# Altium project SJ2088POE.PrjPcb (part 1 of 9)
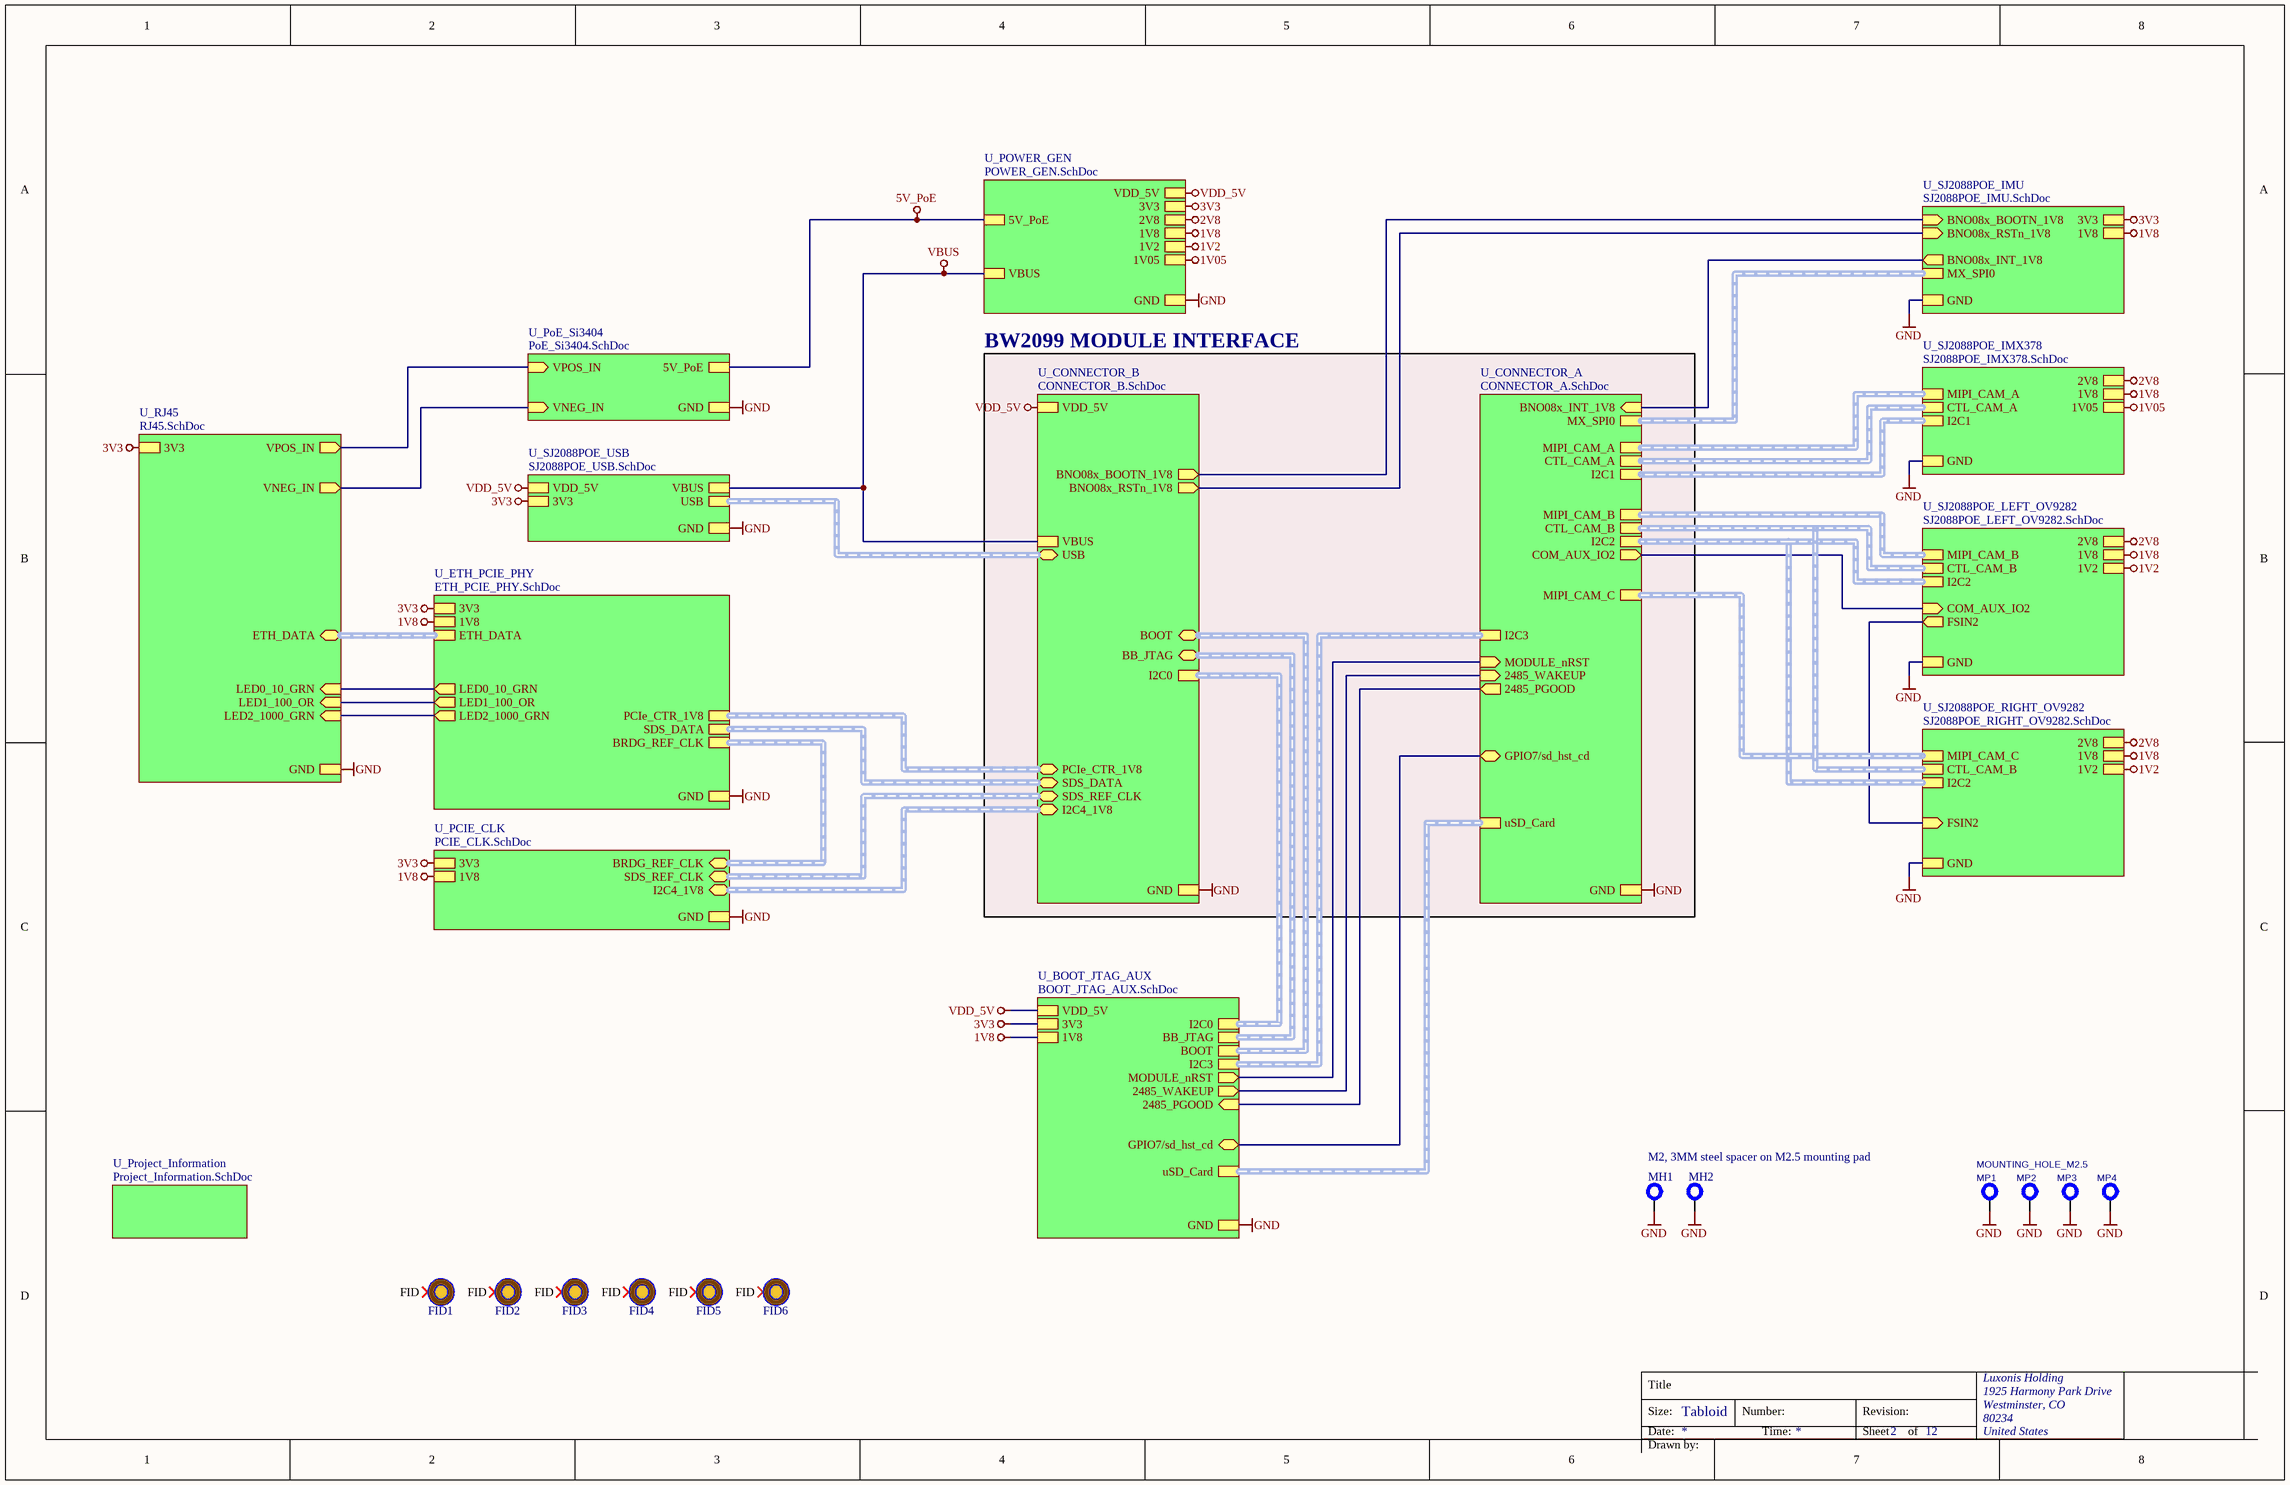
[diagram p0: TopLevel.SchDoc]
revision1: R2M0E2; project_title: SJ2088POE; drawn_by: Brian Weinstein / Sandesh Joshi; document_number: D2088000
15 sheets, 309 parts. Net scope: strictly hierarchical (ports join the sheet entries above them; power ports are local).
Board file: SJ2088POE.PcbDoc
Sheets:
  TopLevel.SchDoc
    U_Project_Information = Project_Information.SchDoc
    U_CONNECTOR_B = CONNECTOR_B.SchDoc
    U_CONNECTOR_A = CONNECTOR_A.SchDoc
    U_ETH_PCIE_PHY = ETH_PCIE_PHY.SchDoc
    U_RJ45 = RJ45.SchDoc
    U_PCIE_CLK = PCIE_CLK.SchDoc
    U_SJ2088POE_USB = SJ2088POE_USB.SchDoc
    U_BOOT_JTAG_AUX = BOOT_JTAG_AUX.SchDoc
    U_PoE_Si3404 = PoE_Si3404.SchDoc
    U_POWER_GEN = POWER_GEN.SchDoc
    U_SJ2088POE_IMX378 = SJ2088POE_IMX378.SchDoc
    U_SJ2088POE_RIGHT_OV9282 = SJ2088POE_RIGHT_OV9282.SchDoc
    U_SJ2088POE_LEFT_OV9282 = SJ2088POE_LEFT_OV9282.SchDoc
    U_SJ2088POE_IMU = SJ2088POE_IMU.SchDoc

## Sheet TopLevel.SchDoc: =project_title
size Tabloid; CompanyName: Luxonis Holding; DrawnBy: Brian Weinstein / Sandesh Joshi; Organization: Luxonis Holding; Address1: 1925 Harmony Park Drive; Address2: Westminster, CO; Address3: 80234; Address4: United States; DocumentNumber: D2088000; SheetNumber: 2; SheetTotal: 12

### Parts
FID1  FIDUCIAL_ROUND_1MM  [FIDUCIAL_ROUND_1MM]  (value not drawn)  (no BOM)
FID2  FIDUCIAL_ROUND_1MM  [FIDUCIAL_ROUND_1MM]  (value not drawn)  (no BOM)
FID3  FIDUCIAL_ROUND_1MM  [FIDUCIAL_ROUND_1MM]  (value not drawn)  (no BOM)
FID4  FIDUCIAL_ROUND_1MM  [FIDUCIAL_ROUND_1MM]  (value not drawn)  (no BOM)
FID5  FIDUCIAL_ROUND_1MM  [FIDUCIAL_ROUND_1MM]  (value not drawn)  (no BOM)
FID6  FIDUCIAL_ROUND_1MM  [FIDUCIAL_ROUND_1MM]  (value not drawn)  (no BOM)
MH1  M2, 3MM steel spacer on M2.5 mounting pad  [9774030243R]
MH2  M2, 3MM steel spacer on M2.5 mounting pad  [9774030243R]  (value not drawn)
MP1  MOUNTING_HOLE_M2.5  [MOUNTING_HOLE_M2.5]  (no BOM)
MP2  MOUNTING_HOLE_M2.5  [MOUNTING_HOLE_M2.5]  (value not drawn)  (no BOM)
MP3  MOUNTING_HOLE_M2.5  [MOUNTING_HOLE_M2.5]  (value not drawn)  (no BOM)
MP4  MOUNTING_HOLE_M2.5  [MOUNTING_HOLE_M2.5]  (value not drawn)  (no BOM)

### Sub-sheets
U_BOOT_JTAG_AUX = BOOT_JTAG_AUX.SchDoc: BOOT (harness BOOT), BB_JTAG (harness BB_JTAG), uSD_Card (harness uSD_Card), 2485_WAKEUP (out), I2C3 (harness I2C3), MODULE_nRST (out), 2485_PGOOD (in), 1V8, 3V3, GND, VDD_5V, I2C0 (harness I2C0), GPIO7/sd_hst_cd (bidir)
U_CONNECTOR_A = CONNECTOR_A.SchDoc: I2C2 (harness I2C2), I2C1 (harness I2C1), uSD_Card (harness uSD_Card), MIPI_CAM_C (harness MIPI_CAM_C), CTL_CAM_A (harness CTL_CAM_A), MIPI_CAM_A (harness MIPI_CAM_A), MIPI_CAM_B (harness MIPI_CAM_B), GND, I2C3 (harness I2C3), CTL_CAM_B (harness CTL_CAM_B), COM_AUX_IO2 (out), MODULE_nRST (in), 2485_WAKEUP (in), 2485_PGOOD (out), GPIO7/sd_hst_cd (bidir), BNO08x_INT_1V8 (in), MX_SPI0 (harness MX_SPI0)
U_CONNECTOR_B = CONNECTOR_B.SchDoc: VBUS, I2C0 (harness I2C0), VDD_5V, GND, BOOT (bidir, harness BOOT), PCIe_CTR_1V8 (bidir, harness PCIe_CTR_1V8), BB_JTAG (bidir, harness BB_JTAG), USB (bidir, harness USB), SDS_REF_CLK (bidir, harness SDS_REF_CLK), I2C4_1V8 (bidir, harness I2C4_1V8), SDS_DATA (bidir, harness Harness), BNO08x_BOOTN_1V8 (out), BNO08x_RSTn_1V8 (out)
U_ETH_PCIE_PHY = ETH_PCIE_PHY.SchDoc: ETH_DATA (harness ETH_DATA), LED0_10_GRN (out), LED1_100_OR (out), LED2_1000_GRN (out), SDS_DATA (harness Harness), 3V3, GND, BRDG_REF_CLK (harness BRDG_REF_CLK), 1V8, PCIe_CTR_1V8 (harness PCIe_CTR_1V8)
U_PCIE_CLK = PCIE_CLK.SchDoc: GND, 3V3, 1V8, BRDG_REF_CLK (bidir, harness BRDG_REF_CLK), I2C4_1V8 (bidir, harness I2C4_1V8), SDS_REF_CLK (bidir, harness SDS_REF_CLK)
U_PoE_Si3404 = PoE_Si3404.SchDoc: 5V_PoE, GND, VPOS_IN (in), VNEG_IN (in)
U_POWER_GEN = POWER_GEN.SchDoc: GND, 3V3, 1V8, 5V_PoE, VBUS, 1V2, 2V8, 1V05, VDD_5V
U_Project_Information = Project_Information.SchDoc: no entries
U_RJ45 = RJ45.SchDoc: GND, LED0_10_GRN (in), 3V3, LED2_1000_GRN (in), LED1_100_OR (in), VPOS_IN (out), VNEG_IN (out), ETH_DATA (bidir, harness ETH_DATA)
U_SJ2088POE_IMU = SJ2088POE_IMU.SchDoc: BNO08x_BOOTN_1V8 (in), GND, 3V3, BNO08x_INT_1V8 (out), BNO08x_RSTn_1V8 (in), 1V8, MX_SPI0 (harness MX_SPI0)
U_SJ2088POE_IMX378 = SJ2088POE_IMX378.SchDoc: 2V8, 1V05, I2C1 (harness I2C1), MIPI_CAM_A (harness MIPI_CAM_A), CTL_CAM_A (harness CTL_CAM_A), GND, 1V8
U_SJ2088POE_LEFT_OV9282 = SJ2088POE_LEFT_OV9282.SchDoc: I2C2 (harness I2C2), CTL_CAM_B (harness CTL_CAM_B), MIPI_CAM_B (harness MIPI_CAM_B), 1V2, 2V8, GND, 1V8, FSIN2 (out), COM_AUX_IO2 (in)
U_SJ2088POE_RIGHT_OV9282 = SJ2088POE_RIGHT_OV9282.SchDoc: MIPI_CAM_C (harness MIPI_CAM_C), I2C2 (harness I2C2), 1V2, 2V8, GND, 1V8, FSIN2 (in), CTL_CAM_B (harness CTL_CAM_B)
U_SJ2088POE_USB = SJ2088POE_USB.SchDoc: USB (harness USB), GND, 3V3, VBUS, VDD_5V

### Nets
1V2: sheet U_POWER_GEN/1V2, sheet U_SJ2088POE_RIGHT_OV9282/1V2, sheet U_SJ2088POE_LEFT_OV9282/1V2
1V05: sheet U_POWER_GEN/1V05, sheet U_SJ2088POE_IMX378/1V05
1V8: sheet U_ETH_PCIE_PHY/1V8, sheet U_PCIE_CLK/1V8, sheet U_BOOT_JTAG_AUX/1V8, sheet U_POWER_GEN/1V8, sheet U_SJ2088POE_IMX378/1V8, sheet U_SJ2088POE_RIGHT_OV9282/1V8, sheet U_SJ2088POE_LEFT_OV9282/1V8, sheet U_SJ2088POE_IMU/1V8
2V8: sheet U_POWER_GEN/2V8, sheet U_SJ2088POE_IMX378/2V8, sheet U_SJ2088POE_RIGHT_OV9282/2V8, sheet U_SJ2088POE_LEFT_OV9282/2V8
3V3: sheet U_ETH_PCIE_PHY/3V3, sheet U_RJ45/3V3, sheet U_PCIE_CLK/3V3, sheet U_SJ2088POE_USB/3V3, sheet U_BOOT_JTAG_AUX/3V3, sheet U_POWER_GEN/3V3, sheet U_SJ2088POE_IMU/3V3
5V_PoE: sheet U_PoE_Si3404/5V_PoE, sheet U_POWER_GEN/5V_PoE
GND: MH1.1 MH2.1 MP1.1 MP2.1 MP3.1 MP4.1 ; sheet U_CONNECTOR_B/GND, sheet U_CONNECTOR_A/GND, sheet U_ETH_PCIE_PHY/GND, sheet U_RJ45/GND, sheet U_PCIE_CLK/GND, sheet U_SJ2088POE_USB/GND, sheet U_BOOT_JTAG_AUX/GND, sheet U_PoE_Si3404/GND, sheet U_POWER_GEN/GND, sheet U_SJ2088POE_IMX378/GND, sheet U_SJ2088POE_RIGHT_OV9282/GND, sheet U_SJ2088POE_LEFT_OV9282/GND, sheet U_SJ2088POE_IMU/GND
VBUS: sheet U_CONNECTOR_B/VBUS, sheet U_SJ2088POE_USB/VBUS, sheet U_POWER_GEN/VBUS
VDD_5V: sheet U_CONNECTOR_B/VDD_5V, sheet U_SJ2088POE_USB/VDD_5V, sheet U_BOOT_JTAG_AUX/VDD_5V, sheet U_POWER_GEN/VDD_5V
VNEG_IN: sheet U_RJ45/VNEG_IN, sheet U_PoE_Si3404/VNEG_IN
2485_PGOOD: sheet U_CONNECTOR_A/2485_PGOOD, sheet U_BOOT_JTAG_AUX/2485_PGOOD
2485_WAKEUP: sheet U_CONNECTOR_A/2485_WAKEUP, sheet U_BOOT_JTAG_AUX/2485_WAKEUP
BNO08x_BOOTN_1V8: sheet U_CONNECTOR_B/BNO08x_BOOTN_1V8, sheet U_SJ2088POE_IMU/BNO08x_BOOTN_1V8
BNO08x_INT_1V8: sheet U_CONNECTOR_A/BNO08x_INT_1V8, sheet U_SJ2088POE_IMU/BNO08x_INT_1V8
BNO08x_RSTn_1V8: sheet U_CONNECTOR_B/BNO08x_RSTn_1V8, sheet U_SJ2088POE_IMU/BNO08x_RSTn_1V8
COM_AUX_IO2: sheet U_CONNECTOR_A/COM_AUX_IO2, sheet U_SJ2088POE_LEFT_OV9282/COM_AUX_IO2
FSIN2: sheet U_SJ2088POE_RIGHT_OV9282/FSIN2, sheet U_SJ2088POE_LEFT_OV9282/FSIN2
GPIO7/sd_hst_cd: sheet U_CONNECTOR_A/GPIO7/sd_hst_cd, sheet U_BOOT_JTAG_AUX/GPIO7/sd_hst_cd
LED0_10_GRN: sheet U_ETH_PCIE_PHY/LED0_10_GRN, sheet U_RJ45/LED0_10_GRN
LED1_100_OR: sheet U_ETH_PCIE_PHY/LED1_100_OR, sheet U_RJ45/LED1_100_OR
LED2_1000_GRN: sheet U_ETH_PCIE_PHY/LED2_1000_GRN, sheet U_RJ45/LED2_1000_GRN
MODULE_nRST: sheet U_CONNECTOR_A/MODULE_nRST, sheet U_BOOT_JTAG_AUX/MODULE_nRST
VPOS_IN: sheet U_RJ45/VPOS_IN, sheet U_PoE_Si3404/VPOS_IN

Not connected (* = marked no-connect by the designer): FID1 FID*; FID2 FID*; FID3 FID*; FID4 FID*; FID5 FID*; FID6 FID*

### Buses and harness runs
harness sheet U_BOOT_JTAG_AUX/BB_JTAG = sheet U_CONNECTOR_B/BB_JTAG
harness sheet U_BOOT_JTAG_AUX/BOOT = sheet U_CONNECTOR_B/BOOT
harness sheet U_BOOT_JTAG_AUX/I2C0 = sheet U_CONNECTOR_B/I2C0
harness sheet U_BOOT_JTAG_AUX/I2C3 = sheet U_CONNECTOR_A/I2C3
harness sheet U_BOOT_JTAG_AUX/uSD_Card = sheet U_CONNECTOR_A/uSD_Card
harness sheet U_CONNECTOR_A/CTL_CAM_A = sheet U_SJ2088POE_IMX378/CTL_CAM_A
harness sheet U_CONNECTOR_A/CTL_CAM_B = sheet U_SJ2088POE_LEFT_OV9282/CTL_CAM_B = sheet U_SJ2088POE_RIGHT_OV9282/CTL_CAM_B
harness sheet U_CONNECTOR_A/I2C1 = sheet U_SJ2088POE_IMX378/I2C1
harness sheet U_CONNECTOR_A/I2C2 = sheet U_SJ2088POE_LEFT_OV9282/I2C2 = sheet U_SJ2088POE_RIGHT_OV9282/I2C2
harness sheet U_CONNECTOR_A/MIPI_CAM_A = sheet U_SJ2088POE_IMX378/MIPI_CAM_A
harness sheet U_CONNECTOR_A/MIPI_CAM_B = sheet U_SJ2088POE_LEFT_OV9282/MIPI_CAM_B
harness sheet U_CONNECTOR_A/MIPI_CAM_C = sheet U_SJ2088POE_RIGHT_OV9282/MIPI_CAM_C
harness sheet U_CONNECTOR_A/MX_SPI0 = sheet U_SJ2088POE_IMU/MX_SPI0
harness sheet U_CONNECTOR_B/I2C4_1V8 = sheet U_PCIE_CLK/I2C4_1V8
harness sheet U_CONNECTOR_B/PCIe_CTR_1V8 = sheet U_ETH_PCIE_PHY/PCIe_CTR_1V8
harness sheet U_CONNECTOR_B/SDS_DATA = sheet U_ETH_PCIE_PHY/SDS_DATA
harness sheet U_CONNECTOR_B/SDS_REF_CLK = sheet U_PCIE_CLK/SDS_REF_CLK
harness sheet U_CONNECTOR_B/USB = sheet U_SJ2088POE_USB/USB
harness sheet U_ETH_PCIE_PHY/BRDG_REF_CLK = sheet U_PCIE_CLK/BRDG_REF_CLK
harness sheet U_ETH_PCIE_PHY/ETH_DATA = sheet U_RJ45/ETH_DATA

### Notes on the sheet
- BW2099 MODULE INTERFACE
- Title
- Size:
- Date:
- Tabloid
- Number:
- Time:
- Revision:
- Sheet
- of
- Drawn by:

### Library data of the parts
FID1-FID6 = FIDUCIAL: Fiducial with various available footprints
MH1 MH2 = 9774030243R: MP ROUND STANDOFF M2X0.4 STEEL 3MM; Manufacturer 1: Wurth Electronics; Plating: Tin; Threaded/Unthreaded: Threaded; Outside Diameter: 0.171inch; Supplier 1: Digi-Key; Manufacturer Part Number 1: 9774030243R; Stock 1: 20568; Pricing 1: 1=0.95000, 10=0.91800, 50=0.79500, 100=0.73900 (USD); RoHS: Yes; Material: Steel; Length: 0.173inch; REACH SVHC: Unknown; ComponentLink1URL: http://www.mouser.com/ds/2/445/9774030243R-611455.pdf?src-supplier=Mouser; ComponentLink1Description: http://www.mouser.com/ds/2/445/9774030243R-611455.pdf?src-supplier=Mouser; ComponentLink2URL: http://www.farnell.com/datasheets/1960368.pdf?src-supplier=Farnell; ComponentLink2Description: http://www.farnell.com/datasheets/1960368.pdf?src-supplier=Farnell; ComponentLink3URL: https://katalog.we-online.de/em/datasheet/9774030243R.pdf?src-supplier=Digi-Key; ComponentLink3Description: https://katalog.we-online.de/em/datasheet/9774030243R.pdf?src-supplier=Digi-Key; ComponentLink4URL: http://www.farnell.com/datasheets/1960368.pdf?src-supplier=Newark; ComponentLink4Description: http://www.farnell.com/datasheets/1960368.pdf?src-supplier=Newark; ComponentLink5URL: http://www.farnell.com/datasheets/1960368.pdf?src-supplier=Element14; ComponentLink5Description: http://www.farnell.com/datasheets/1960368.pdf?src-supplier=Element14; Supplier Part Number 1: 732-7085-1-ND; Supplier 2: Mouser; Supplier Part Number 2: 710-9774030243R; Supplier 3: Element14; Supplier Part Number 3: 2497599
MP1-MP4 = MP_Mounting-Holes: =CurrentFootprint; B - Value: Not a Part; A - Level: 0

## Sheet Project_Information.SchDoc: =project_title
size Tabloid; CompanyName: Luxonis Holding; DrawnBy: Brian Weinstein / Sandesh Joshi; Organization: Luxonis Holding; Address1: 1925 Harmony Park Drive; Address2: Westminster, CO; Address3: 80234; Address4: United States; DocumentNumber: D2088000; Revision: R2M0E2; SheetNumber: 1; SheetTotal: 12
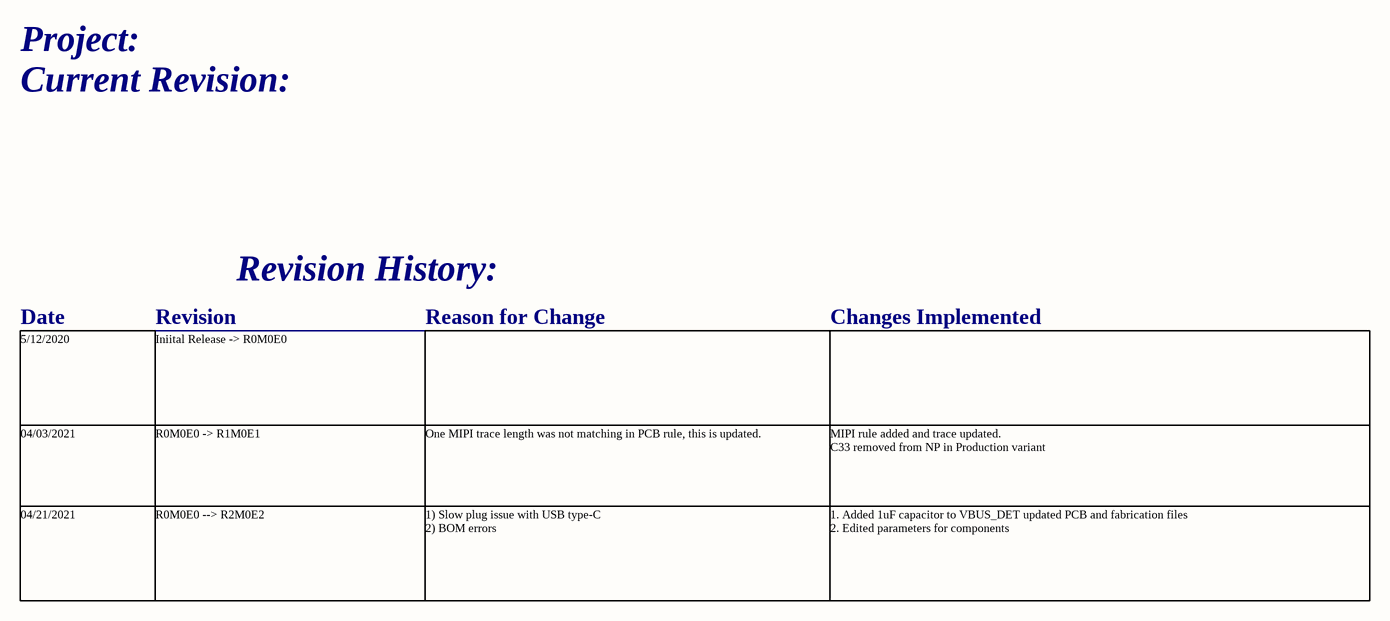
[diagram p1: Project_Information.SchDoc]

### Notes on the sheet
- Project:
- Current Revision:
- Revision History:
- Date
- Revision
- Reason for Change
- Changes Implemented
- 5/12/2020
- Iniital Release -> R0M0E0
- 04/03/2021
- R0M0E0 -> R1M0E1
- One MIPI trace length was not matching in PCB rule, this is updated.
- MIPI rule added and trace updated.
  C33 removed from NP in Production variant
- 04/21/2021
- R0M0E0 --> R2M0E2
- 1) Slow plug issue with USB type-C
  2) BOM errors
- 1. Added 1uF capacitor to VBUS_DET updated PCB and fabrication files
  2. Edited parameters for components
- Title
- Size:
- Date:
- Tabloid
- Number:
- Time:
- Revision:
- Sheet
- of
- Drawn by:

## Sheet CONNECTOR_B.SchDoc: =project_title
size Tabloid; CompanyName: Luxonis Holding; DrawnBy: Brian Weinstein / Sandesh Joshi; Organization: Luxonis Holding; Address1: 1925 Harmony Park Drive; Address2: Westminster, CO; Address3: 80234; Address4: United States; DocumentNumber: D2088000; SheetNumber: 6; SheetTotal: 12
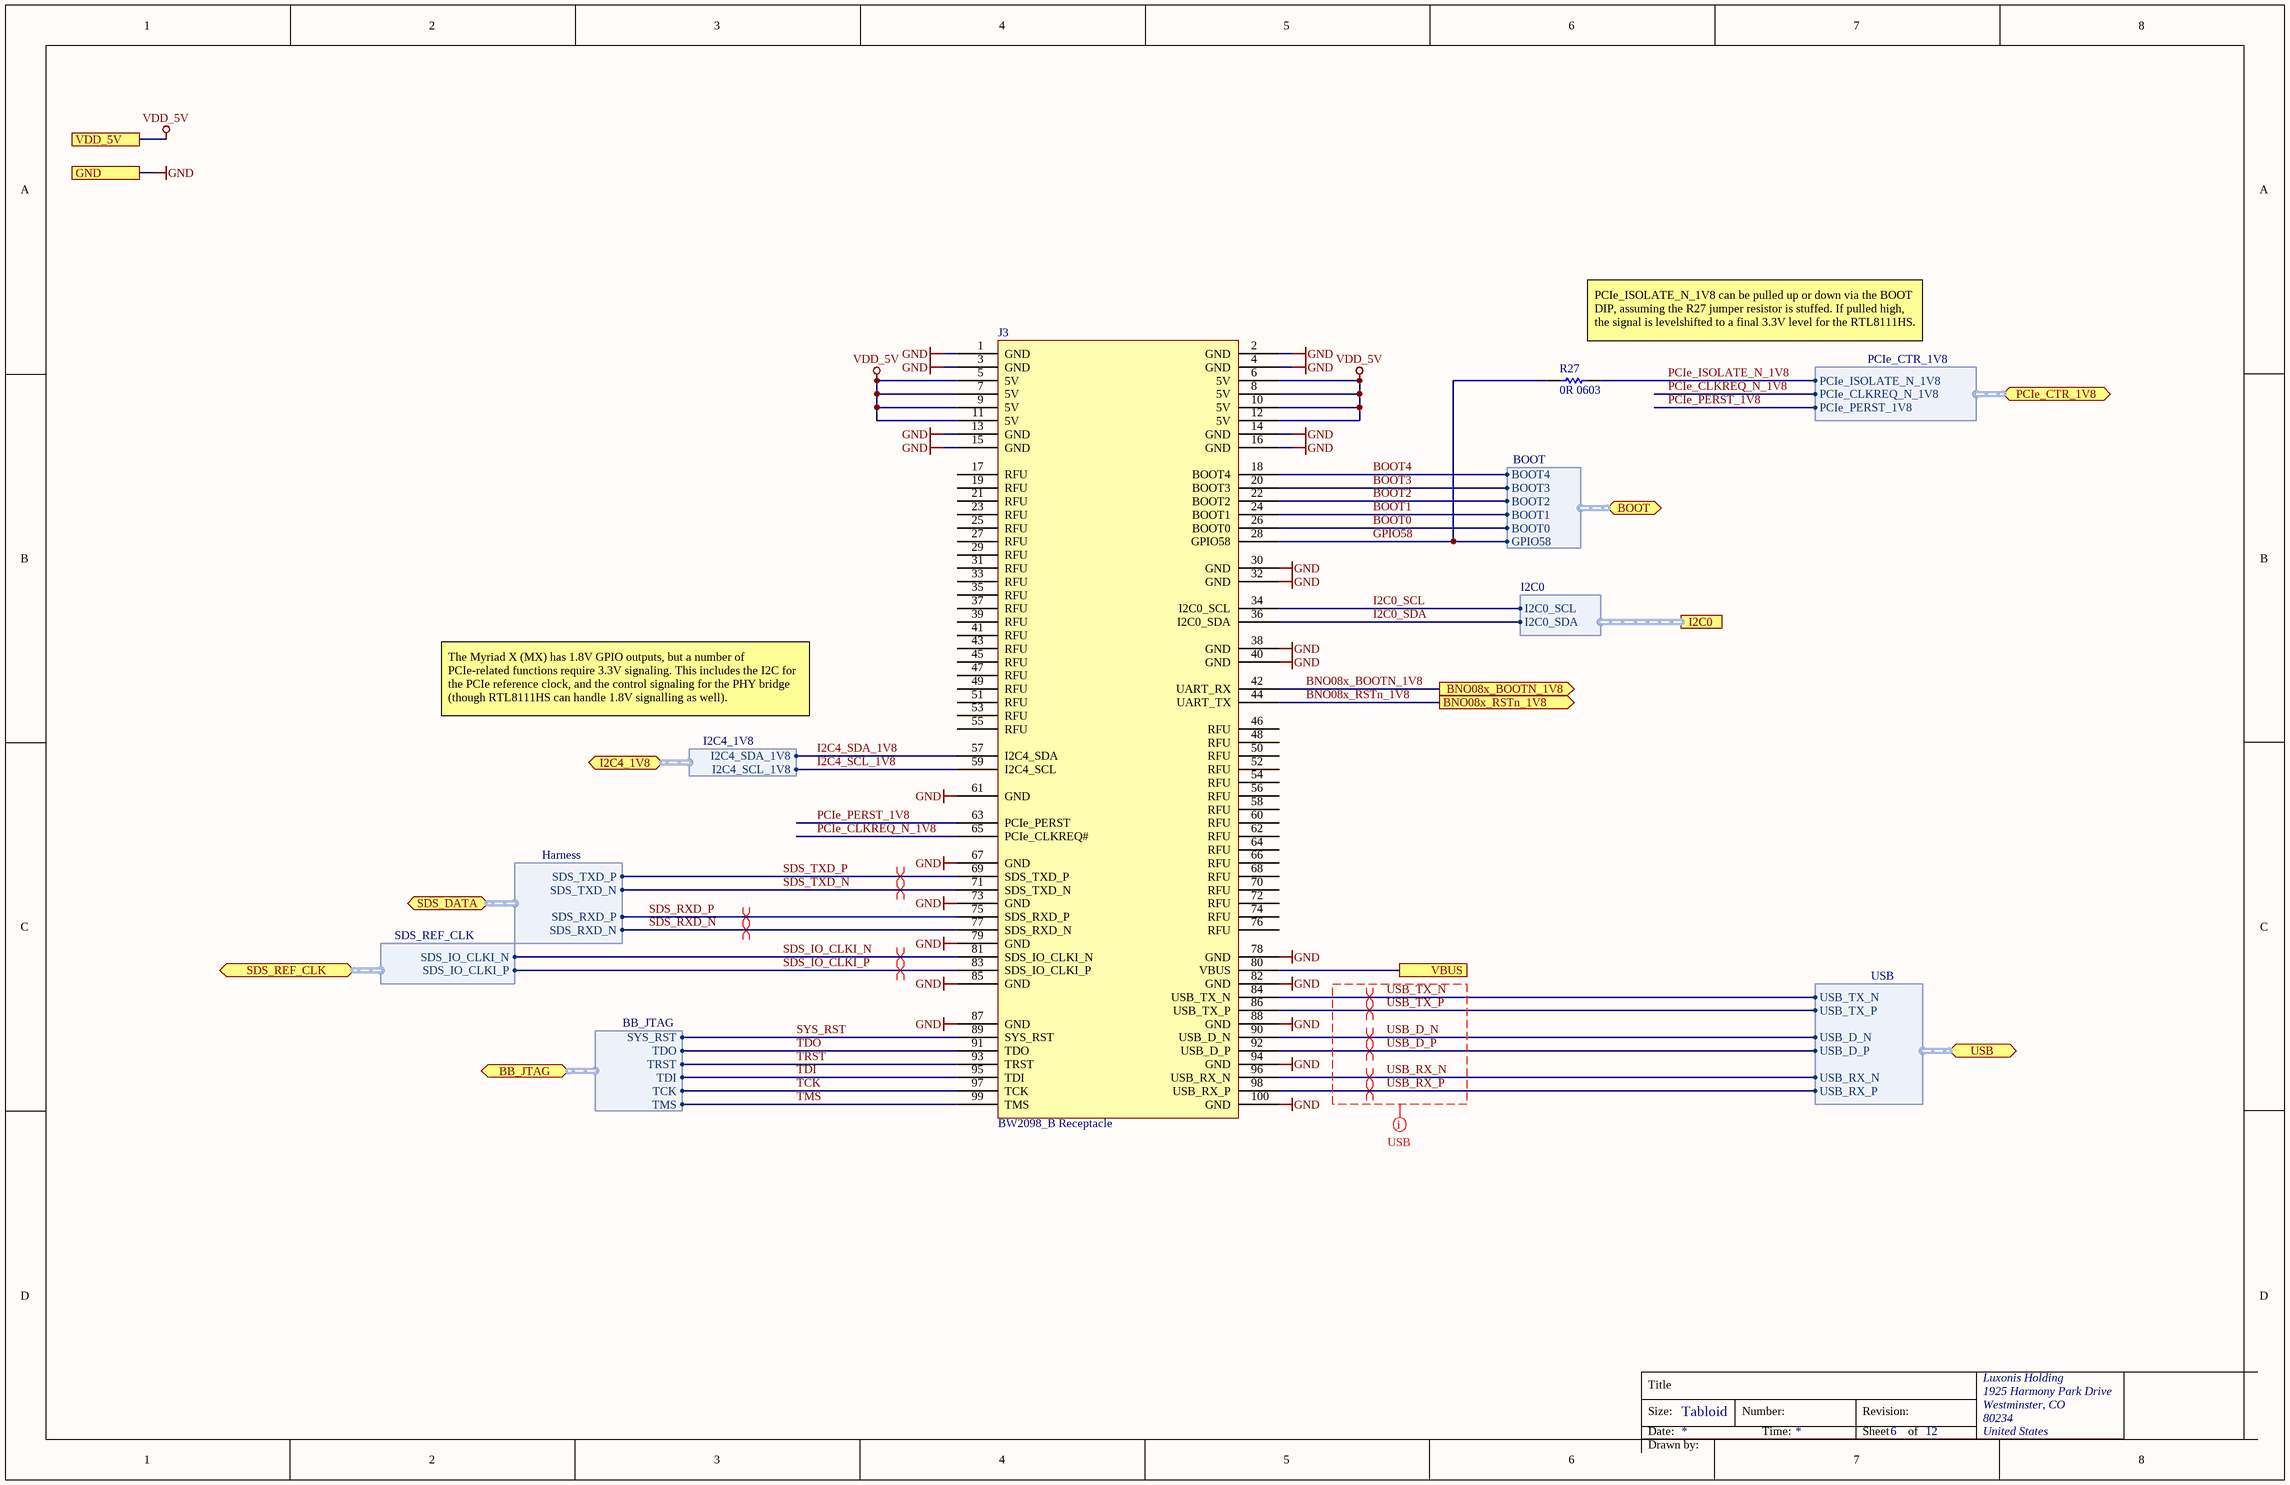
[diagram p2: CONNECTOR_B.SchDoc]

### Parts
J3  BW2098_B Receptacle  [DF40HC-3.0-100DS-0.4V_minpad]
R27  0R 0603  [RESC0603(1608)_N]

### Ports
BB_JTAG (bidir, harness BB_JTAG), BNO08x_BOOTN_1V8 (out), BNO08x_RSTn_1V8 (out), BOOT (bidir, harness BOOT), GND, I2C0 (harness I2C0), I2C4_1V8 (bidir, harness I2C4_1V8), PCIe_CTR_1V8 (bidir, harness PCIe_CTR_1V8), SDS_DATA (bidir, harness Harness), SDS_REF_CLK (bidir, harness SDS_REF_CLK), USB (bidir, harness USB), VBUS, VDD_5V

### Harnesses
USB: USB_RX_P, USB_RX_N, USB_D_P, USB_D_N, USB_TX_P, USB_TX_N
BOOT: BOOT4, BOOT3, BOOT2, BOOT1, BOOT0, GPIO58
I2C0: I2C0_SDA, I2C0_SCL
BB_JTAG: SYS_RST, TDO, TRST, TDI, TCK, TMS
SDS_REF_CLK: SDS_IO_CLKI_P, SDS_IO_CLKI_N
Harness: SDS_TXD_P, SDS_TXD_N, SDS_RXD_P, SDS_RXD_N
I2C4_1V8: I2C4_SDA_1V8, I2C4_SCL_1V8
PCIe_CTR_1V8: PCIe_CLKREQ_N_1V8, PCIe_ISOLATE_N_1V8, PCIe_PERST_1V8

### Nets
GND: J3.1(GND) J3.2(GND) J3.3(GND) J3.4(GND) J3.13(GND) J3.14(GND) J3.15(GND) J3.16(GND) J3.30(GND) J3.32(GND) J3.38(GND) J3.40(GND) J3.61(GND) J3.67(GND) J3.73(GND) J3.78(GND) J3.79(GND) J3.82(GND) J3.85(GND) J3.87(GND) J3.88(GND) J3.94(GND) J3.100(GND) ; port GND
VBUS: J3.80(VBUS) ; port VBUS
VDD_5V: J3.5(5V) J3.6(5V) J3.7(5V) J3.8(5V) J3.9(5V) J3.10(5V) J3.11(5V) J3.12(5V) ; port VDD_5V
BNO08x_BOOTN_1V8: J3.42(UART_RX) ; port BNO08x_BOOTN_1V8
BNO08x_RSTn_1V8: J3.44(UART_TX) ; port BNO08x_RSTn_1V8
BOOT0: J3.26(BOOT0) ; port BOOT.BOOT0
BOOT1: J3.24(BOOT1) ; port BOOT.BOOT1
BOOT2: J3.22(BOOT2) ; port BOOT.BOOT2
BOOT3: J3.20(BOOT3) ; port BOOT.BOOT3
BOOT4: J3.18(BOOT4) ; port BOOT.BOOT4
GPIO58: J3.28(GPIO58) R27.1 ; port BOOT.GPIO58
I2C0_SCL: J3.34(I2C0_SCL) ; port I2C0.I2C0_SCL
I2C0_SDA: J3.36(I2C0_SDA) ; port I2C0.I2C0_SDA
I2C4_SCL_1V8: J3.59(I2C4_SCL) ; port I2C4_1V8.I2C4_SCL_1V8
I2C4_SDA_1V8: J3.57(I2C4_SDA) ; port I2C4_1V8.I2C4_SDA_1V8
PCIe_CLKREQ_N_1V8: J3.65(PCIe_CLKREQ#) ; port PCIe_CTR_1V8.PCIe_CLKREQ_N_1V8
PCIe_ISOLATE_N_1V8: R27.2 ; port PCIe_CTR_1V8.PCIe_ISOLATE_N_1V8
PCIe_PERST_1V8: J3.63(PCIe_PERST) ; port PCIe_CTR_1V8.PCIe_PERST_1V8
SDS_IO_CLKI_N: J3.81(SDS_IO_CLKI_N) ; port SDS_REF_CLK.SDS_IO_CLKI_N
SDS_IO_CLKI_P: J3.83(SDS_IO_CLKI_P) ; port SDS_REF_CLK.SDS_IO_CLKI_P
SDS_RXD_N: J3.77(SDS_RXD_N) ; port SDS_DATA.SDS_RXD_N
SDS_RXD_P: J3.75(SDS_RXD_P) ; port SDS_DATA.SDS_RXD_P
SDS_TXD_N: J3.71(SDS_TXD_N) ; port SDS_DATA.SDS_TXD_N
SDS_TXD_P: J3.69(SDS_TXD_P) ; port SDS_DATA.SDS_TXD_P
SYS_RST: J3.89(SYS_RST) ; port BB_JTAG.SYS_RST
TCK: J3.97(TCK) ; port BB_JTAG.TCK
TDI: J3.95(TDI) ; port BB_JTAG.TDI
TDO: J3.91(TDO) ; port BB_JTAG.TDO
TMS: J3.99(TMS) ; port BB_JTAG.TMS
TRST: J3.93(TRST) ; port BB_JTAG.TRST
USB_D_N: J3.90(USB_D_N) ; port USB.USB_D_N
USB_D_P: J3.92(USB_D_P) ; port USB.USB_D_P
USB_RX_N: J3.96(USB_RX_N) ; port USB.USB_RX_N
USB_RX_P: J3.98(USB_RX_P) ; port USB.USB_RX_P
USB_TX_N: J3.84(USB_TX_N) ; port USB.USB_TX_N
USB_TX_P: J3.86(USB_TX_P) ; port USB.USB_TX_P

Not connected (* = marked no-connect by the designer): J3 17(RFU) 19(RFU) 21(RFU) 23(RFU) 25(RFU) 27(RFU) 29(RFU) 31(RFU) 33(RFU) 35(RFU) 37(RFU) 39(RFU) 41(RFU) 43(RFU) 45(RFU) 46(RFU) 47(RFU) 48(RFU) 49(RFU) 50(RFU) 51(RFU) 52(RFU) 53(RFU) 54(RFU) 55(RFU) 56(RFU) 58(RFU) 60(RFU) 62(RFU) 64(RFU) 66(RFU) 68(RFU) 70(RFU) 72(RFU) 74(RFU) 76(RFU)

### Layout directives
net class USB: USB_D_N, USB_D_P, USB_RX_N, USB_RX_P, USB_TX_N, USB_TX_P
differential pair; differential pair class 100ohm: SDS_IO_CLKI_N, SDS_IO_CLKI_P, SDS_RXD_N, SDS_RXD_P, SDS_TXD_N, SDS_TXD_P
differential pair; differential pair class USB3: USB_D_N, USB_D_P, USB_RX_N, USB_RX_P, USB_TX_N, USB_TX_P

### Notes on the sheet
- PCIe_ISOLATE_N is wired up on the MV0247 via GPIO58, but does not exist in the MV0235 design.
- (near R27) PCIe_ISOLATE_N_1V8 can be pulled up or down via the BOOT DIP, assuming the R27 jumper resistor is stuffed. If pulled high, the signal is levelshifted to a final 3.3V level for the RTL8111HS.
- The Myriad X (MX) has 1.8V GPIO outputs, but a number of PCIe-related functions require 3.3V signaling. This includes the I2C for the PCIe reference clock, and the control signaling for the PHY bridge (though RTL8111HS can handle 1.8V signalling as well).
- Title
- Size:
- Date:
- Tabloid
- Number:
- Time:
- Revision:
- Sheet
- of
- Drawn by:

### Library data of the parts
J3 = DF40HC(3.0)-100DS-0.4V_BW2098_B: CONN RCPT 100POS 0.4MM SMD GOLD BW2098_B Receptacle; Manufacturer 1: Hirose; Number of Positions: 100; Pitch: 0.016inch; System: Connector; RoHS: Yes; Mount: Surface Mount; Contact Plating: Gold; Packaging: Tape and Reel; Number of Rows: 2; Package Quantity: 1000; Connector Type: Receptacle; Lead Free: Lead Free; ComponentLink1URL: https://datasheet.ciiva.com/46636/ed-df40-20140305-46636517.pdf?src-supplier=Digi-Key; ComponentLink1Description: https://datasheet.ciiva.com/46636/ed-df40-20140305-46636517.pdf?src-supplier=Digi-Key; ComponentLink2URL: https://datasheet.ciiva.com/18562/ed-df40-20140305-18562189.pdf?src-supplier=Digi-Key; ComponentLink2Description: https://datasheet.ciiva.com/18562/ed-df40-20140305-18562189.pdf?src-supplier=Digi-Key; ComponentLink3URL: https://datasheet.ciiva.com/13559/ed-df40-20140305-13559540.pdf?src-supplier=Mouser; ComponentLink3Description: https://datasheet.ciiva.com/13559/ed-df40-20140305-13559540.pdf?src-supplier=Mouser; ComponentLink4URL: https://datasheet.ciiva.com/18562/ed-df40-20140305-18562462.pdf?src-supplier=Digi-Key; ComponentLink4Description: https://datasheet.ciiva.com/18562/ed-df40-20140305-18562462.pdf?src-supplier=Digi-Key; Supplier 1: Mouser; Stock 1: 2172; Pricing 1: 1=2.54000, 10=2.26000, 25=2.07000, 50=2.07000, 100=1.98000, 250=1.79000, 500=1.65000, 1000=1.41000, 3000=1.32000, 6000=1.23000, 10000=1.23000 (USD); Supplier 2: Mouser; Manufacturer 2: Hirose; Manufacturer Part Number 2: DF40HC(3.0)-100DS-0.4V(58); Stock 2: 2078; Pricing 2: 1=2.50000, 10=2.40000, 25=2.10000, 50=2.10000, 100=2.00000, 250=1.76000, 500=1.71000, 1000=1.45000, 2000=1.36000, 5000=1.31000, 10000=1.31000 (USD); Supplier Part Number 1: 798-DF40HC30100DS451; Supplier Part Number 2: 798-DF40HC30100DS458
R27 = CRCW06030000Z0EA: RES SMD 0 OHM JUMPER 1/10W 0603 0 Ohms Jumper 0.1W, 1/10W Chip Resistor 0603 (1608 Metric) Automotive AEC-Q200 Thick Film; Manufacturer 1: Vishay; Manufacturer Part Number 1: CRCW0603-0000Z0EA; Resistance: 0mR; Power Rating: 100mW; Voltage Rating: 75V; Temperature Coefficient: 100ppm/°C; Tolerance: 5%; Current Rating: 2A; Supplier 1: Digi-Key; Stock 1: 742743; Pricing 1: 1=0.100000, 10=0.034000, 25=0.024400, 50=0.018600, 100=0.013800, 250=0.010480, 500=0.008400, 1000=0.006180 (USD); RoHS: Yes; Mount: Surface Mount; Case/Package: 0603; Weight: 7.1E-05oz; Contact Plating: Tin,Lead; Case Code (Metric): 1608; Case Code (Imperial): 0603; Min Operating Temperature: -55°C; Max Operating Temperature: 155°C; Composition: Thick Film; Termination: SMD/SMT; Packaging: Tape and Reel; Package Quantity: 1; Number of Terminations: 2; Military Standard: Not; Max Power Dissipation: 100mW; Voltage Rating (DC): 75V; Features: Automotive AEC-Q200; Working Voltage: 75V; Length: 1.55mm; Height: 0.02inch; Width: 0.033inch; Depth: 0.85mm; Radiation Hardening: No; Lead Free: Lead Free; REACH SVHC: Unknown; ComponentLink1URL: https://datasheet.ciiva.com/2461/dcrcwe3-2461968.pdf?src-supplier=Digi-Key; ComponentLink1Description: https://datasheet.ciiva.com/2461/dcrcwe3-2461968.pdf?src-supplier=Digi-Key; ComponentLink2URL: https://datasheet.ciiva.com/2461/dcrcwe3-2461969.pdf?src-supplier=Digi-Key; ComponentLink2Description: https://datasheet.ciiva.com/2461/dcrcwe3-2461969.pdf?src-supplier=Digi-Key; ComponentLink3URL: https://datasheet.ciiva.com/2461/dcrcwe3-2461970.pdf?src-supplier=Digi-Key; ComponentLink3Description: https://datasheet.ciiva.com/2461/dcrcwe3-2461970.pdf?src-supplier=Digi-Key; ComponentLink4URL: https://datasheet.ciiva.com/8340/dcrcwe3-8340197.pdf?src-supplier=Avnet; ComponentLink4Description: https://datasheet.ciiva.com/8340/dcrcwe3-8340197.pdf?src-supplier=Avnet; ComponentLink5URL: https://datasheet.ciiva.com/16941/dcrcw-16941302.pdf?src-supplier=Avnet+Europe; ComponentLink5Description: https://datasheet.ciiva.com/16941/dcrcw-16941302.pdf?src-supplier=Avnet+Europe; ComponentLink6URL: https://datasheet.ciiva.com/16199/dcrcwe3-16199063.pdf?src-supplier=Future+Electronics; ComponentLink6Description: https://datasheet.ciiva.com/16199/dcrcwe3-16199063.pdf?src-supplier=Future+Electronics; ComponentLink7URL: https://datasheet.ciiva.com/16725/70201119-16725175.pdf?src-supplier=Allied+Electronics; ComponentLink7Description: https://datasheet.ciiva.com/16725/70201119-16725175.pdf?src-supplier=Allied+Electronics; ComponentLink8URL: https://datasheet.ciiva.com/26316/fld-crcw-e3-data-en-26316615.pdf?src-supplier=Distrelec; ComponentLink8Description: https://datasheet.ciiva.com/26316/fld-crcw-e3-data-en-26316615.pdf?src-supplier=Distrelec; ComponentLink9URL: https://datasheet.ciiva.com/5544/dcrcwe3-109170-5544344.pdf?src-supplier=Mouser; ComponentLink9Description: https://datasheet.ciiva.com/5544/dcrcwe3-109170-5544344.pdf?src-supplier=Mouser; ComponentLink10URL: https://datasheet.ciiva.com/7841/1720486-7841816.pdf?src-supplier=Element14; ComponentLink10Description: https://datasheet.ciiva.com/7841/1720486-7841816.pdf?src-supplier=Element14; ComponentLink11URL: https://datasheet.ciiva.com/7841/1720486-7841817.pdf?src-supplier=Element14; ComponentLink11Description: https://datasheet.ciiva.com/7841/1720486-7841817.pdf?src-supplier=Element14; ComponentLink12URL: https://datasheet.ciiva.com/7841/125364-7841818.pdf?src-supplier=Element14; ComponentLink12Description: https://datasheet.ciiva.com/7841/125364-7841818.pdf?src-supplier=Element14; ComponentLink13URL: https://datasheet.ciiva.com/16721/70201119-16721450.pdf?src-supplier=Allied+Electronics; ComponentLink13Description: https://datasheet.ciiva.com/16721/70201119-16721450.pdf?src-supplier=Allied+Electronics; Supplier Part Number 1: 541-0.0GCT-ND

## Sheet CONNECTOR_A.SchDoc: =project_title
size Tabloid; CompanyName: Luxonis Holding; DrawnBy: Brian Weinstein / Sandesh Joshi; Organization: Luxonis Holding; Address1: 1925 Harmony Park Drive; Address2: Westminster, CO; Address3: 80234; Address4: United States; DocumentNumber: D2088000; SheetNumber: 5; SheetTotal: 12
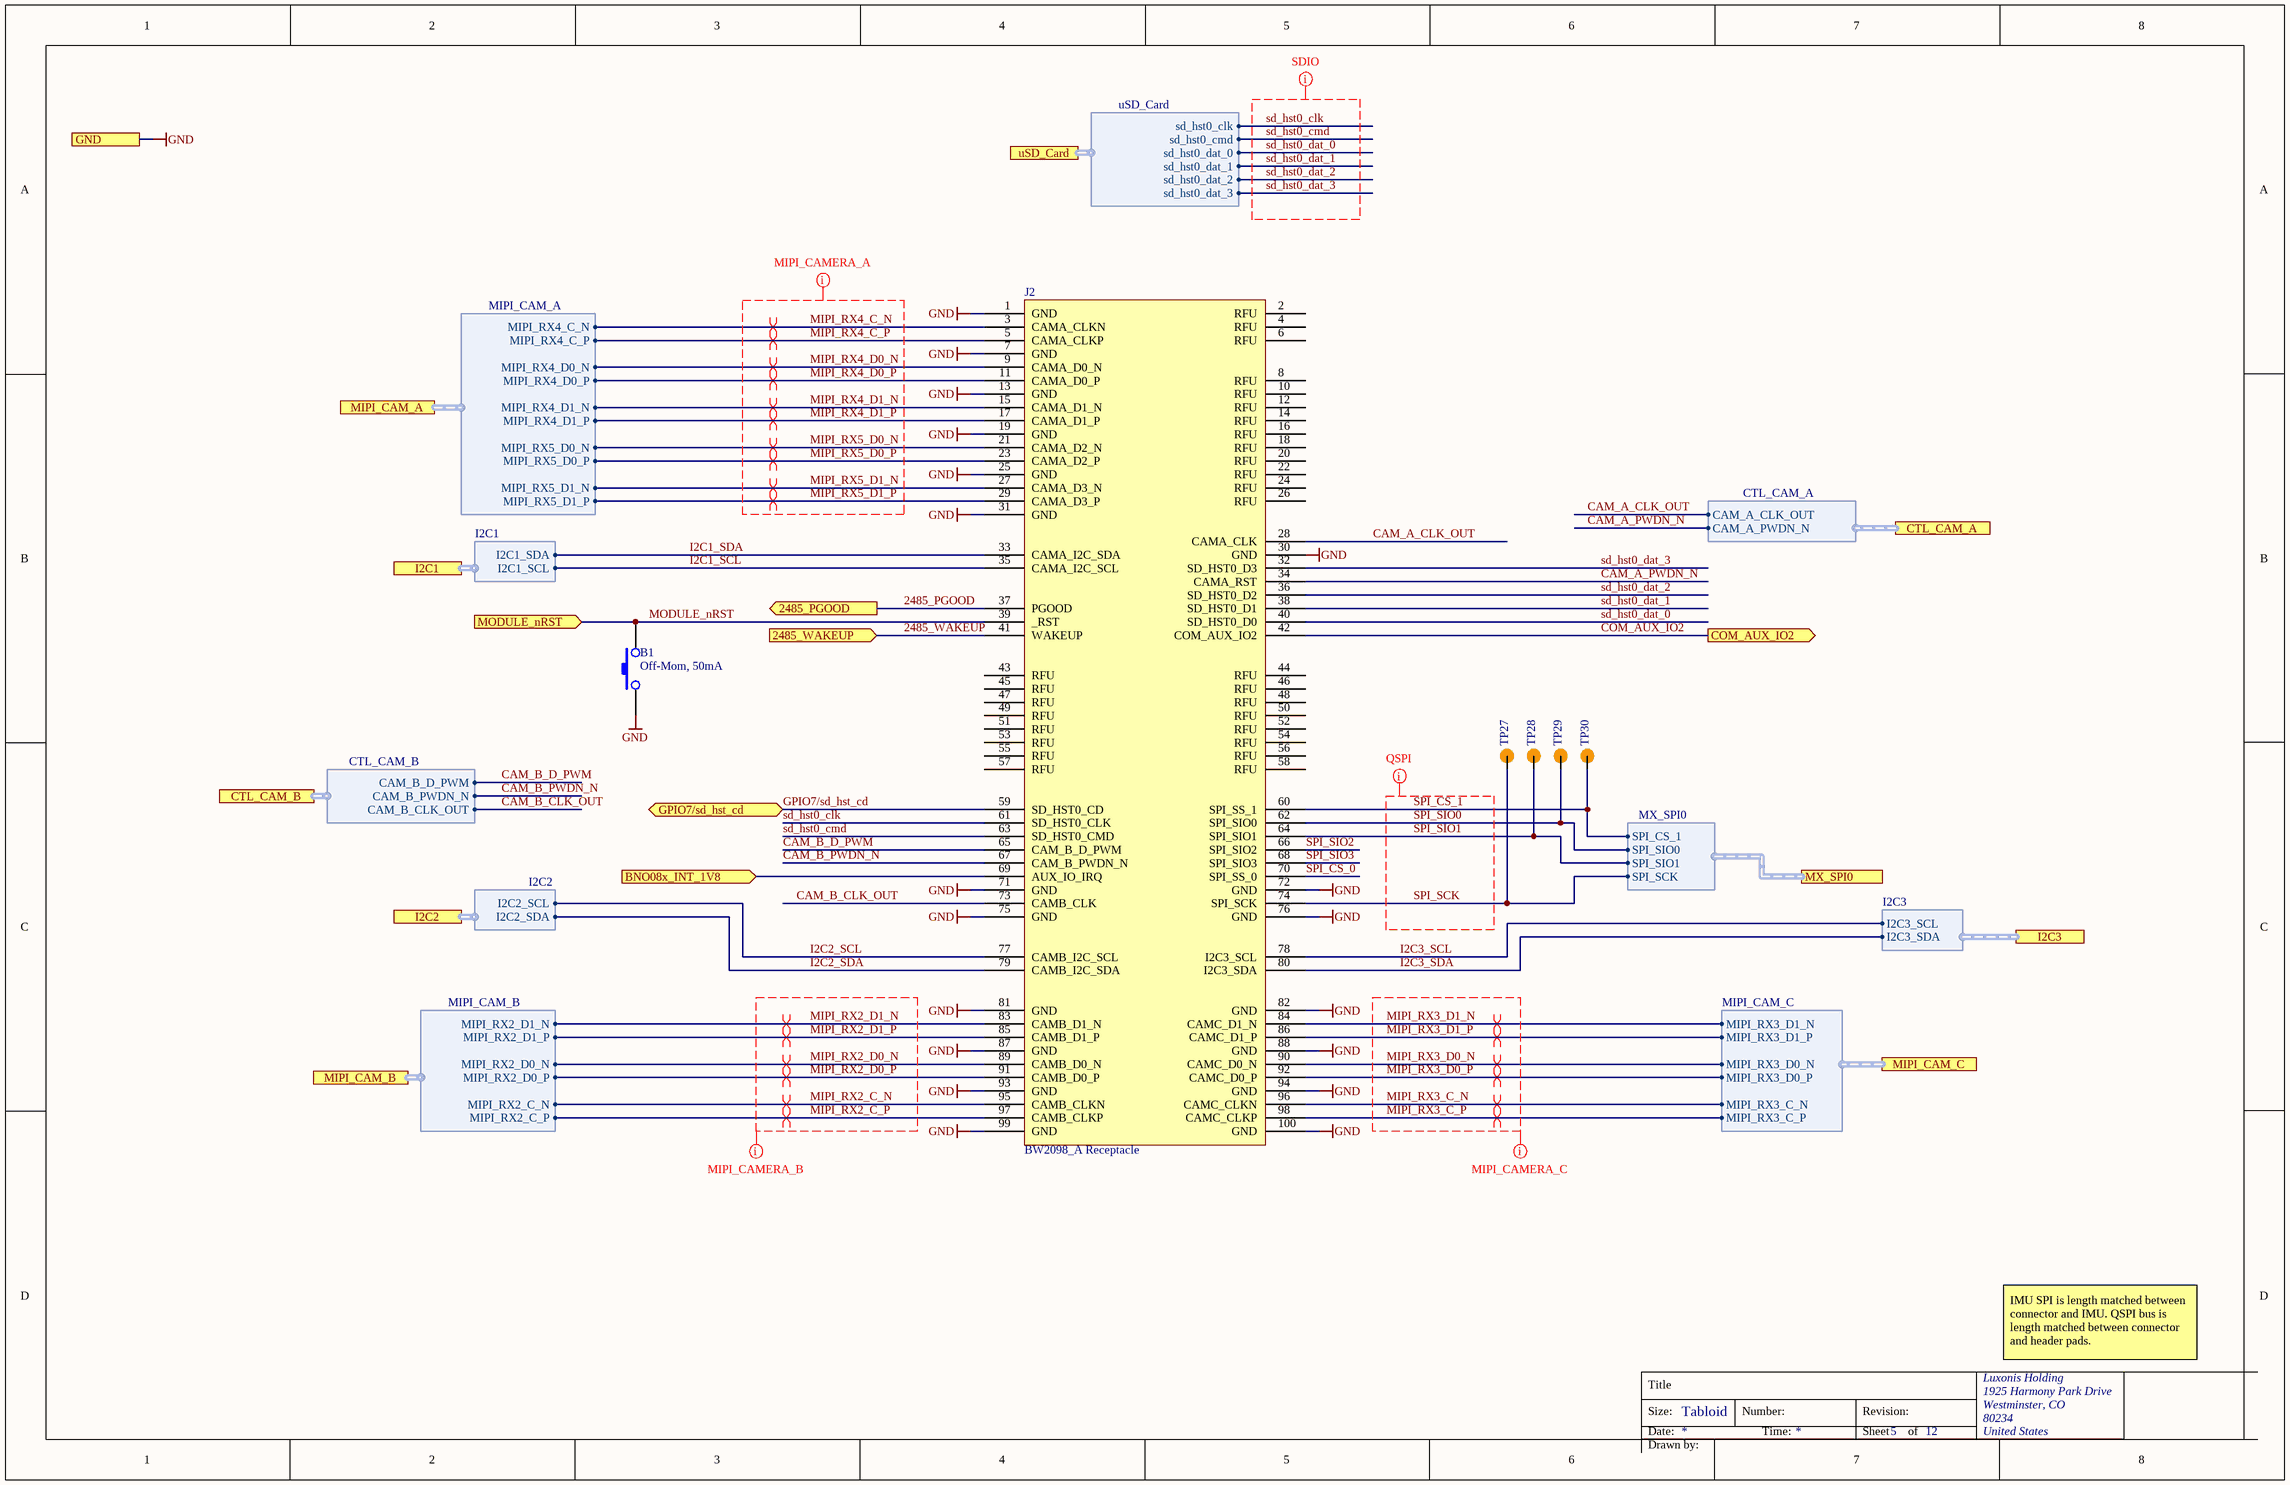
[diagram p3: CONNECTOR_A.SchDoc]

### Parts
B1  Off-Mom, 50mA  [DTSM-32N-V]
J2  BW2098_A Receptacle  [DF40HC-3.0-100DS-0.4V_minpad]
TP27  TP100_200_NS  [TP100_200_NS]  (value not drawn)  (no BOM)
TP28  TP100_200_NS  [TP100_200_NS]  (value not drawn)  (no BOM)
TP29  TP100_200_NS  [TP100_200_NS]  (value not drawn)  (no BOM)
TP30  TP100_200_NS  [TP100_200_NS]  (value not drawn)  (no BOM)

### Ports
2485_PGOOD (out), 2485_WAKEUP (in), BNO08x_INT_1V8 (in), COM_AUX_IO2 (out), CTL_CAM_A (harness CTL_CAM_A), CTL_CAM_B (harness CTL_CAM_B), GND, GPIO7/sd_hst_cd (bidir), I2C1 (harness I2C1), I2C2 (harness I2C2), I2C3 (harness I2C3), MIPI_CAM_A (harness MIPI_CAM_A), MIPI_CAM_B (harness MIPI_CAM_B), MIPI_CAM_C (harness MIPI_CAM_C), MODULE_nRST (in), MX_SPI0 (harness MX_SPI0), uSD_Card (harness uSD_Card)

### Harnesses
MIPI_CAM_B: MIPI_RX2_C_P, MIPI_RX2_C_N, MIPI_RX2_D0_P, MIPI_RX2_D0_N, MIPI_RX2_D1_P, MIPI_RX2_D1_N
MIPI_CAM_A: MIPI_RX4_C_N, MIPI_RX4_C_P, MIPI_RX4_D0_N, MIPI_RX4_D0_P, MIPI_RX4_D1_N, MIPI_RX4_D1_P, MIPI_RX5_D0_N, MIPI_RX5_D0_P, MIPI_RX5_D1_N, MIPI_RX5_D1_P
MIPI_CAM_C: MIPI_RX3_C_P, MIPI_RX3_C_N, MIPI_RX3_D0_P, MIPI_RX3_D0_N, MIPI_RX3_D1_P, MIPI_RX3_D1_N
I2C2: I2C2_SDA, I2C2_SCL
I2C1: I2C1_SDA, I2C1_SCL
CTL_CAM_B: CAM_B_PWDN_N, CAM_B_D_PWM, CAM_B_CLK_OUT
I2C3: I2C3_SDA, I2C3_SCL
CTL_CAM_A: CAM_A_PWDN_N, CAM_A_CLK_OUT
uSD_Card: sd_hst0_clk, sd_hst0_cmd, sd_hst0_dat_0, sd_hst0_dat_1, sd_hst0_dat_2, sd_hst0_dat_3
MX_SPI0: SPI_SIO0, SPI_SIO1, SPI_CS_1, SPI_SCK

### Nets
GND: B1.1 J2.1(GND) J2.7(GND) J2.13(GND) J2.19(GND) J2.25(GND) J2.30(GND) J2.31(GND) J2.71(GND) J2.72(GND) J2.75(GND) J2.76(GND) J2.81(GND) J2.82(GND) J2.87(GND) J2.88(GND) J2.93(GND) J2.94(GND) J2.99(GND) J2.100(GND) ; port GND
2485_PGOOD: J2.37(PGOOD) ; port 2485_PGOOD
2485_WAKEUP: J2.41(WAKEUP) ; port 2485_WAKEUP
BNO08x_INT_1V8: J2.69(AUX_IO_IRQ) ; port BNO08x_INT_1V8
CAM_A_CLK_OUT: J2.28(CAMA_CLK) ; port CTL_CAM_A.CAM_A_CLK_OUT
CAM_A_PWDN_N: J2.34(CAMA_RST) ; port CTL_CAM_A.CAM_A_PWDN_N
CAM_B_CLK_OUT: J2.73(CAMB_CLK) ; port CTL_CAM_B.CAM_B_CLK_OUT
CAM_B_D_PWM: J2.65(CAM_B_D_PWM) ; port CTL_CAM_B.CAM_B_D_PWM
CAM_B_PWDN_N: J2.67(CAM_B_PWDN_N) ; port CTL_CAM_B.CAM_B_PWDN_N
COM_AUX_IO2: J2.42(COM_AUX_IO2) ; port COM_AUX_IO2
GPIO7/sd_hst_cd: J2.59(SD_HST0_CD) ; port GPIO7/sd_hst_cd
I2C1_SCL: J2.35(CAMA_I2C_SCL) ; port I2C1.I2C1_SCL
I2C1_SDA: J2.33(CAMA_I2C_SDA) ; port I2C1.I2C1_SDA
I2C2_SCL: J2.77(CAMB_I2C_SCL) ; port I2C2.I2C2_SCL
I2C2_SDA: J2.79(CAMB_I2C_SDA) ; port I2C2.I2C2_SDA
I2C3_SCL: J2.78(I2C3_SCL) ; port I2C3.I2C3_SCL
I2C3_SDA: J2.80(I2C3_SDA) ; port I2C3.I2C3_SDA
MIPI_RX2_C_N: J2.95(CAMB_CLKN) ; port MIPI_CAM_B.MIPI_RX2_C_N
MIPI_RX2_C_P: J2.97(CAMB_CLKP) ; port MIPI_CAM_B.MIPI_RX2_C_P
MIPI_RX2_D0_N: J2.89(CAMB_D0_N) ; port MIPI_CAM_B.MIPI_RX2_D0_N
MIPI_RX2_D0_P: J2.91(CAMB_D0_P) ; port MIPI_CAM_B.MIPI_RX2_D0_P
MIPI_RX2_D1_N: J2.83(CAMB_D1_N) ; port MIPI_CAM_B.MIPI_RX2_D1_N
MIPI_RX2_D1_P: J2.85(CAMB_D1_P) ; port MIPI_CAM_B.MIPI_RX2_D1_P
MIPI_RX3_C_N: J2.96(CAMC_CLKN) ; port MIPI_CAM_C.MIPI_RX3_C_N
MIPI_RX3_C_P: J2.98(CAMC_CLKP) ; port MIPI_CAM_C.MIPI_RX3_C_P
MIPI_RX3_D0_N: J2.90(CAMC_D0_N) ; port MIPI_CAM_C.MIPI_RX3_D0_N
MIPI_RX3_D0_P: J2.92(CAMC_D0_P) ; port MIPI_CAM_C.MIPI_RX3_D0_P
MIPI_RX3_D1_N: J2.84(CAMC_D1_N) ; port MIPI_CAM_C.MIPI_RX3_D1_N
MIPI_RX3_D1_P: J2.86(CAMC_D1_P) ; port MIPI_CAM_C.MIPI_RX3_D1_P
MIPI_RX4_C_N: J2.3(CAMA_CLKN) ; port MIPI_CAM_A.MIPI_RX4_C_N
MIPI_RX4_C_P: J2.5(CAMA_CLKP) ; port MIPI_CAM_A.MIPI_RX4_C_P
MIPI_RX4_D0_N: J2.9(CAMA_D0_N) ; port MIPI_CAM_A.MIPI_RX4_D0_N
MIPI_RX4_D0_P: J2.11(CAMA_D0_P) ; port MIPI_CAM_A.MIPI_RX4_D0_P
MIPI_RX4_D1_N: J2.15(CAMA_D1_N) ; port MIPI_CAM_A.MIPI_RX4_D1_N
MIPI_RX4_D1_P: J2.17(CAMA_D1_P) ; port MIPI_CAM_A.MIPI_RX4_D1_P
MIPI_RX5_D0_N: J2.21(CAMA_D2_N) ; port MIPI_CAM_A.MIPI_RX5_D0_N
MIPI_RX5_D0_P: J2.23(CAMA_D2_P) ; port MIPI_CAM_A.MIPI_RX5_D0_P
MIPI_RX5_D1_N: J2.27(CAMA_D3_N) ; port MIPI_CAM_A.MIPI_RX5_D1_N
MIPI_RX5_D1_P: J2.29(CAMA_D3_P) ; port MIPI_CAM_A.MIPI_RX5_D1_P
MODULE_nRST: B1.2 J2.39(_RST) ; port MODULE_nRST
sd_hst0_clk: J2.61(SD_HST0_CLK) ; port uSD_Card.sd_hst0_clk
sd_hst0_cmd: J2.63(SD_HST0_CMD) ; port uSD_Card.sd_hst0_cmd
sd_hst0_dat_0: J2.40(SD_HST0_D0) ; port uSD_Card.sd_hst0_dat_0
sd_hst0_dat_1: J2.38(SD_HST0_D1) ; port uSD_Card.sd_hst0_dat_1
sd_hst0_dat_2: J2.36(SD_HST0_D2) ; port uSD_Card.sd_hst0_dat_2
sd_hst0_dat_3: J2.32(SD_HST0_D3) ; port uSD_Card.sd_hst0_dat_3
SPI_CS_0: J2.70(SPI_SS_0)
SPI_CS_1: J2.60(SPI_SS_1) TP30.1 ; port MX_SPI0.SPI_CS_1  [project net BNO08x_CS_1V8]
SPI_SCK: J2.74(SPI_SCK) TP27.1 ; port MX_SPI0.SPI_SCK  [project net BNO08x_SCK_1V8]
SPI_SIO0: J2.62(SPI_SIO0) TP29.1 ; port MX_SPI0.SPI_SIO0  [project net BNO08x_COPI_1V8]
SPI_SIO1: J2.64(SPI_SIO1) TP28.1 ; port MX_SPI0.SPI_SIO1  [project net BNO08x_CIPO_1V8]
SPI_SIO2: J2.66(SPI_SIO2)
SPI_SIO3: J2.68(SPI_SIO3)

Not connected (* = marked no-connect by the designer): J2 2(RFU) 4(RFU) 6(RFU) 8(RFU) 10(RFU) 12(RFU) 14(RFU) 16(RFU) 18(RFU) 20(RFU) 22(RFU) 24(RFU) 26(RFU) 43(RFU) 44(RFU) 45(RFU) 46(RFU) 47(RFU) 48(RFU) 49(RFU) 50(RFU) 51(RFU) 52(RFU) 53(RFU) 54(RFU) 55(RFU) 56(RFU) 57(RFU) 58(RFU)

### Layout directives
differential pair; differential pair class 100ohm: MIPI_RX2_C_N, MIPI_RX2_C_P, MIPI_RX2_D0_N, MIPI_RX2_D0_P, MIPI_RX2_D1_N, MIPI_RX2_D1_P, MIPI_RX3_C_N, MIPI_RX3_C_P, MIPI_RX3_D0_N, MIPI_RX3_D0_P, MIPI_RX3_D1_N, MIPI_RX3_D1_P, MIPI_RX4_C_N, MIPI_RX4_C_P, MIPI_RX4_D0_N, MIPI_RX4_D0_P, MIPI_RX4_D1_N, MIPI_RX4_D1_P, MIPI_RX5_D0_N, MIPI_RX5_D0_P, MIPI_RX5_D1_N, MIPI_RX5_D1_P
net class MIPI_CAM_A: MIPI_RX4_C_N, MIPI_RX4_C_P, MIPI_RX4_D0_N, MIPI_RX4_D0_P, MIPI_RX4_D1_N, MIPI_RX4_D1_P, MIPI_RX5_D0_N, MIPI_RX5_D0_P, MIPI_RX5_D1_N, MIPI_RX5_D1_P
net class MIPI_CAM_C: MIPI_RX3_C_N, MIPI_RX3_C_P, MIPI_RX3_D0_N, MIPI_RX3_D0_P, MIPI_RX3_D1_N, MIPI_RX3_D1_P
net class MIPI_CAM_B: MIPI_RX2_C_N, MIPI_RX2_C_P, MIPI_RX2_D0_N, MIPI_RX2_D0_P, MIPI_RX2_D1_N, MIPI_RX2_D1_P
net class QSPI: SPI_CS_1, SPI_SCK, SPI_SIO0, SPI_SIO1
net class SDIO: sd_hst0_clk, sd_hst0_cmd, sd_hst0_dat_0, sd_hst0_dat_1, sd_hst0_dat_2, sd_hst0_dat_3

### Notes on the sheet
- IMU SPI is length matched between connector and IMU. QSPI bus is length matched between connector and header pads.
- Title
- Size:
- Date:
- Tabloid
- Number:
- Time:
- Revision:
- Sheet
- of
- Drawn by:

### Library data of the parts
B1 = DTSM-32N-V: SWITCH TACTILE SMT 3.5mm * 6mm , brown 160gf; Manufacturer 1: Diptronics; Manufacturer Part Number 1: DTSM-32N-V-T/R; Supplier 1: Mouser; Stock 1: 3199; Pricing 1: 1=0.38000, 10=0.38000, 50=0.31000, 100=0.28200, 500=0.25600, 1000=0.23600, 1600=0.20900, 4800=0.18800, 9600=0.17300, 10000=0.17300, 24000=0.16100 (USD); RoHS: No; Min Operating Temperature: -30°C; Max Operating Temperature: 80°C; Length: 6mm; Height: 5mm; Width: 3.5mm; ComponentLink1URL: https://datasheet.ciiva.com/29188/708548-da-01-en-tastschalter-smd-dtsm-32n-v-tr-1600st-29188823.pdf?src-supplier=Conrad; ComponentLink1Description: https://datasheet.ciiva.com/29188/708548-da-01-en-tastschalter-smd-dtsm-32n-v-tr-1600st-29188823.pdf?src-supplier=Conrad; Supplier Part Number 1: 113-DTSM32NVTR
J2 = DF40HC(3.0)-100DS-0.4V_BW2098_A: CONN RCPT 100POS 0.4MM SMD GOLD BW2098_A Receptacle; Manufacturer 1: Hirose; Number of Positions: 100; Pitch: 0.016inch; System: Connector; RoHS: Yes; Mount: Surface Mount; Contact Plating: Gold; Packaging: Tape and Reel; Number of Rows: 2; Package Quantity: 1000; Connector Type: Receptacle; Lead Free: Lead Free; ComponentLink1URL: https://datasheet.ciiva.com/46636/ed-df40-20140305-46636517.pdf?src-supplier=Digi-Key; ComponentLink1Description: https://datasheet.ciiva.com/46636/ed-df40-20140305-46636517.pdf?src-supplier=Digi-Key; ComponentLink2URL: https://datasheet.ciiva.com/18562/ed-df40-20140305-18562189.pdf?src-supplier=Digi-Key; ComponentLink2Description: https://datasheet.ciiva.com/18562/ed-df40-20140305-18562189.pdf?src-supplier=Digi-Key; ComponentLink3URL: https://datasheet.ciiva.com/13559/ed-df40-20140305-13559540.pdf?src-supplier=Mouser; ComponentLink3Description: https://datasheet.ciiva.com/13559/ed-df40-20140305-13559540.pdf?src-supplier=Mouser; ComponentLink4URL: https://datasheet.ciiva.com/18562/ed-df40-20140305-18562462.pdf?src-supplier=Digi-Key; ComponentLink4Description: https://datasheet.ciiva.com/18562/ed-df40-20140305-18562462.pdf?src-supplier=Digi-Key; Supplier 1: Mouser; Stock 1: 2172; Pricing 1: 1=2.54000, 10=2.26000, 25=2.07000, 50=2.07000, 100=1.98000, 250=1.79000, 500=1.65000, 1000=1.41000, 3000=1.32000, 6000=1.23000, 10000=1.23000 (USD); Supplier 2: Mouser; Manufacturer 2: Hirose; Manufacturer Part Number 2: DF40HC(3.0)-100DS-0.4V(58); Stock 2: 2078; Pricing 2: 1=2.50000, 10=2.40000, 25=2.10000, 50=2.10000, 100=2.00000, 250=1.76000, 500=1.71000, 1000=1.45000, 2000=1.36000, 5000=1.31000, 10000=1.31000 (USD); Supplier Part Number 1: 798-DF40HC30100DS451; Supplier Part Number 2: 798-DF40HC30100DS458
TP27-TP30 = TEST_POINT